# EAGLE design rftoy1.1 (EAGLE 7.1.0)
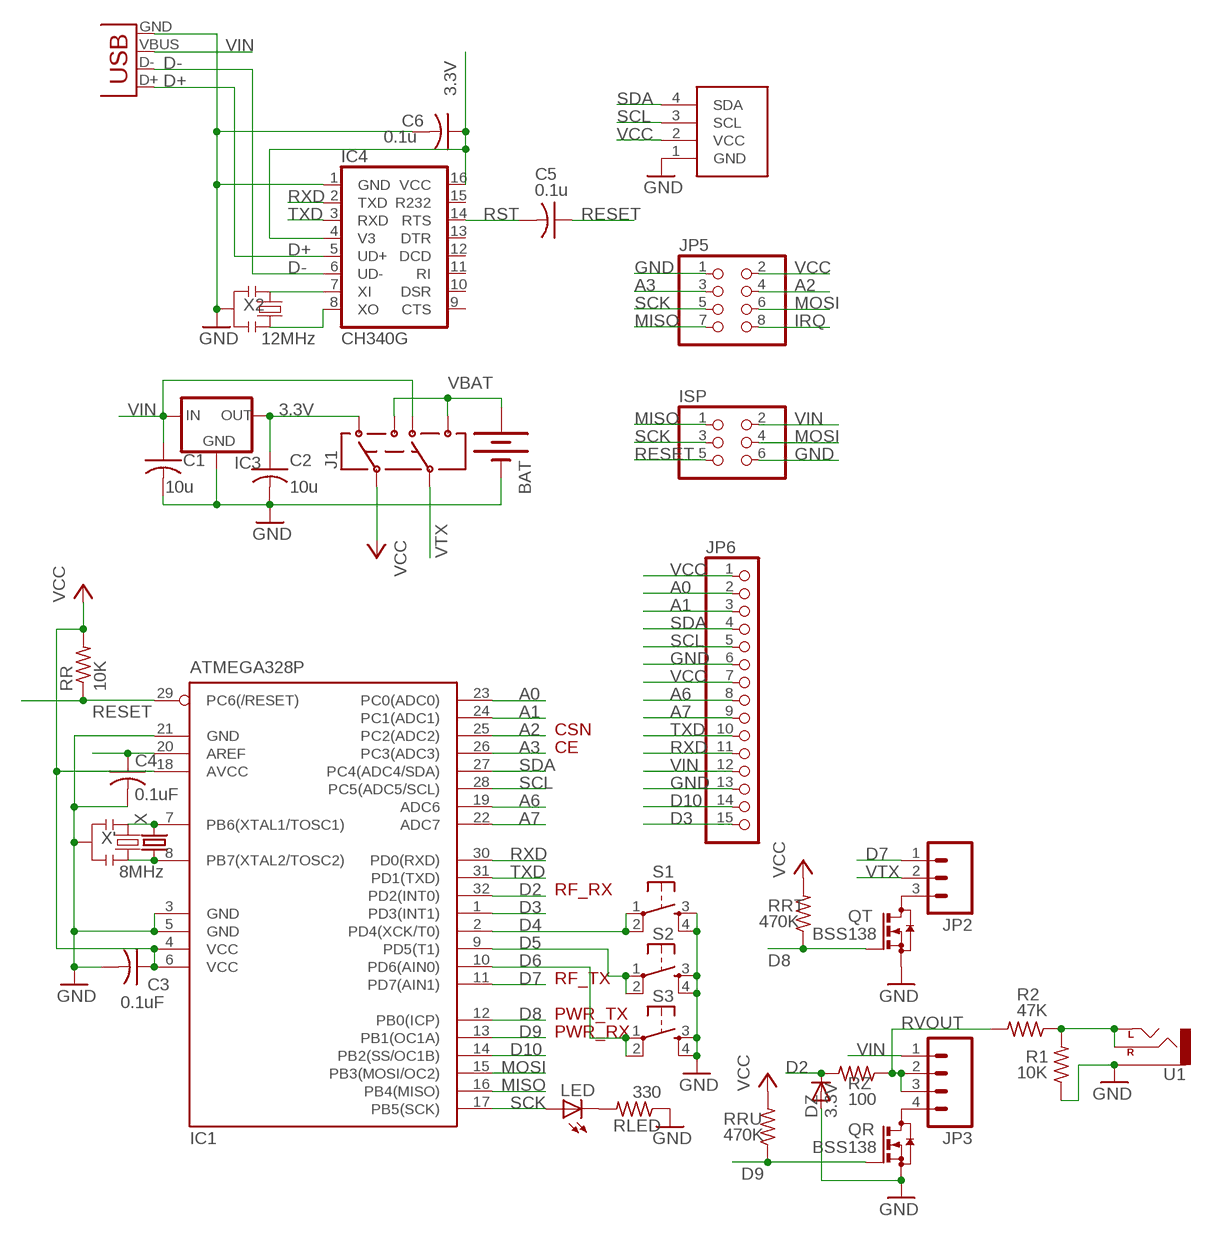
[diagram p0: schematic, sheet 1]

## Parts
BAT  BATTERY20PTH  [BATTCOM_20MM_PTH]
C1  10u  C-USC0805K  [C0805K]
C2  10u  C-USC0805K  [C0805K]
C3  0.1uF  C-USC0603K  [C0603K]
C4  0.1uF  C-USC0603K  [C0603K]
C5  0.1u  C-USC0603K  [C0603K]
C6  0.1u  C-USC0603K  [C0603K]
DZ  3.3V  DIODE-MINIMELF  [MINIMELF]
IC1  ATMEGA328P  MEGA8-AI  [TQFP32-08]
IC3  MCP1700SOT233  [SOT23]
IC4  CH340G  [SO16]
ISP  PINHD-2X3  [2X03]
J1  AYZ0202  [AYZ0202]
JP2  M03LOCK_LONGPADS  [1X03_LOCK_LONGPADS]
JP3  M04LOCK  [1X04_LOCK]
JP5  PINHD-2X4  [2X04]
JP6  PINHD-1X15-CB  [1X15-CB]
LED  LEDCHIPLED_0805  [CHIPLED_0805]
QR  BSS138  BSS123  [SOT23]
QT  BSS138  BSS123  [SOT23]
R1  10K  R-US_R0805  [R0805]
R2  47K  R-US_R0805  [R0805]
RLED  330  R-US_R0805  [R0805]
RR  10K  R-US_R0805  [R0805]
RRT  470K  R-US_R0805  [R0805]
RRU  470K  R-US_R0805  [R0805]
RZ  100  R-US_R0805  [R0805]
S1  TAC_SWITCHPTH  [TACTILE-PTH]
S2  TAC_SWITCHPTH  [TACTILE-PTH]
S3  TAC_SWITCHPTH  [TACTILE-PTH]
U1  AUDIO-JACKSMD3  [AUDIO-JACK-3.5MM-SMD3]
U$1  SSD1306_OLED_I2C  [SSD1306_OLED_I2C]
X  CRYSTALTC26V  [TC26V]
X1  USBSMD  [USB-MINIB]
X2  12MHz  RESONATORSMD  [RESONATOR-SMD]
X'  8MHz  RESONATORSMD  [RESONATOR-SMD]

## Nets
3.3V [power]: C2.1 C6.1 IC3.2(OUT) IC4.4(V3) IC4.16(VCC) J1.3
A0: IC1.23(PC0(ADC0)) JP6.2
A1: IC1.24(PC1(ADC1)) JP6.3
A2: IC1.25(PC2(ADC2)) JP5.4
A3: IC1.26(PC3(ADC3)) JP5.3
A6: IC1.19(ADC6) JP6.8
A7: IC1.22(ADC7) JP6.9
AREF: C4.1 IC1.20(AREF)
D2: DZ.C IC1.32(PD2(INT0)) RZ.2
D3: IC1.1(PD3(INT1)) JP6.15
D4: IC1.2(PD4(XCK/T0)) S1.1 S1.2
D5: IC1.9(PD5(T1)) S2.1 S2.2
D6: IC1.10(PD6(AIN0)) S3.1 S3.2
D7: IC1.11(PD7(AIN1)) JP2.1
D8: IC1.12(PB0(ICP)) QT.1(G) RRT.1
D9: IC1.13(PB1(OC1A)) QR.1(G) RRU.1
D10: IC1.14(PB2(SS/OC1B)) JP6.14
D+: IC4.5(UD+) X1.D+
D-: IC4.6(UD-) X1.D-
GND [power]: BAT.2(-) C1.2 C2.2 C3.2 C4.2 C6.2 DZ.A IC1.3(GND) IC1.5(GND) IC1.21(GND) IC3.1(GND) IC4.1(GND) ISP.6 JP5.1 JP6.6 JP6.13 QR.2(S) QT.2(S) R1.1 RLED.1 S1.3 S1.4 S2.3 S2.4 S3.3 S3.4 U1.RING(SLEEVE) U$1.1(GND) X1.GND X2.2 X'.2
IRQ: JP5.8
MISO: IC1.16(PB4(MISO)) ISP.1 JP5.7
MOSI: IC1.15(PB3(MOSI/OC2)) ISP.4 JP5.6
N$1: LED.C RLED.2
N$2: IC1.7(PB6(XTAL1/TOSC1)) X'.1 X.2
N$3: IC1.8(PB7(XTAL2/TOSC2)) X'.3 X.1
N$4: R1.2 R2.1 U1.MID(RIGHT) U1.TIP(LEFT)
N$6: JP3.4 QR.3(D)
N$8: JP2.3 QT.3(D)
N$11: IC4.7(XI) X2.1
N$13: IC4.8(XO) X2.3
RESET: C5.1 IC1.29(PC6(/RESET)) ISP.5 RR.1
RST: C5.2 IC4.14(RTS)
RVOUT: JP3.2 JP3.3 R2.2 RZ.1
RXD: IC1.30(PD0(RXD)) IC4.2(TXD) JP6.11
SCK: IC1.17(PB5(SCK)) ISP.3 JP5.5 LED.A
SCL: IC1.28(PC5(ADC5/SCL)) JP6.5 U$1.3(SCL)
SDA: IC1.27(PC4(ADC4/SDA)) JP6.4 U$1.4(SDA)
TXD: IC1.31(PD1(TXD)) IC4.3(RXD) JP6.10
VBAT [power]: BAT.1(+) J1.1 J1.4
VCC: C3.1 IC1.4(VCC) IC1.6(VCC) IC1.18(AVCC) J1.2 JP5.2 JP6.1 JP6.7 RR.2 RRT.2 RRU.2 U$1.2(VCC)
VIN [power]: C1.1 IC3.3(IN) ISP.2 J1.6 JP3.1 JP6.12 X1.VBUS
VTX [power]: J1.5 JP2.2
Unconnected: IC4.9(CTS) IC4.10(DSR) IC4.11(RI) IC4.12(DCD) IC4.13(DTR) IC4.15(R232)

## Notes on the sheet
- CSN
- CE
- RF_RX
- RF_TX
- PWR_TX
- PWR_RX

## Library data of the parts
BAT = SparkFun:BATTERY: Battery Holders Various common sizes : AA, AAA, 20mm coin cell and 12mm coin cell.
C1-C4 = adafruit2013:C-US: CAPACITOR, American symbol
C5 C6 = adafruit:C-US: CAPACITOR, American symbol
DZ = diode:DIODE-: DIODE
IC1 = atmel:MEGA8: MICROCONTROLLER 8 Kbytes FLASH, 1 kbytes SRAM, 512 bytes EEPROM, USART, 6-channel 10 bit ADC, 2-channel 8 bit ADC Pin compatible with Atmega48, ATMega88, ATMega168 Source: avr.lbr; MPN: ATMEGA8-16AU; OC_FARNELL: 9171371; OC_NEWARK: 73M8863
IC3 = adafruit:MCP1700: VOLTAGE REGULATOR
IC4 = SparkFunNew:CH340
ISP = pinhead:PINHD-2X3: PIN HEADER
J1 = SparkFunNew:AYZ0202: SPDT Slide Switch Simple SMD single-pull double-throw slide switch. Good for less than 350mA power switch, switching UARTs between devices, etc. Spark Fun Electronics SKU : COM-00597
JP2 = SparkFun:M03: Header 3 Standard 3-pin 0.1" header. Use with straight break away headers (SKU : PRT-00116), right angle break away headers (PRT-00553), swiss pins (PRT-00743), machine pins (PRT-00117), and female headers (PRT-00115). Molex polarized connector foot print use with SKU : PRT-08232 with associated crimp pins and housings.
JP3 = SparkFun:M04: Header 4 Standard 4-pin 0.1" header. Use with straight break away headers (SKU : PRT-00116), right angle break away headers (PRT-00553), swiss pins (PRT-00743), machine pins (PRT-00117), and female headers (PRT-00115). Molex polarized connector foot print use with SKU : PRT-08231 with associated crimp pins and housings.
JP5 = adafruit2013:PINHD-2X4: PIN HEADER
JP6 = adafruit2013:PINHD-1X15: PIN HEADER
LED = adafruit:LED: LED OSRAM: - CHIPLED LG R971, LG N971, LY N971, LG Q971, LY Q971, LO R971, LY R971 LH N974, LH R974 LS Q976, LO Q976, LY Q976 LO Q996 - Hyper CHIPLED LW Q18S LB Q993, LB Q99A, LB R99A - SideLED LS A670, LO A670, LY A670, LG A670, LP A670 LB A673, LV A673, LT A673, LW A673 LH A674 LY A675 LS A676, LA A676, LO A676, LY A676, LW A676 LS A679, LY A679, LG A679 - Hyper Micro SIDELED® LS Y876, LA Y876, LO Y876, LY Y876 LT Y87S - SmartLED LW L88C, LW L88S LB L89C, LB L89S, LG L890 LS L89K, LO L89K, LY L89K LS L896, LA L896, LO L896, LY L896 - TOPLED LS T670, LO T670, LY T670, LG T670, LP T670 LSG T670, LSP T670, LSY T670, LOP T670, LYG T670 LG T671, LOG T671, LSG T671 LB T673, LV T673, LT T673, LW T673 LH T674 LS T676, LA T676, LO T676, LY T676, LB T676, LH T676, LSB T676, LW T676 LB T67C, LV T67C, LT T67C, LS T67K, LO T67K, LY T67K, LW E67C LS E67B, LA E67B, LO E67B, LY E67B, LB E67C, LV E67C, LT E67C LW T67C LS T679, LY T679, LG T679 LS T770, LO T770, LY T770, LG T770, LP T770 LB T773, LV T773, LT T773, LW T773 LH T774 LS E675, LA E675, LY E675, LS T675 LS T776, LA T776, LO T776, LY T776, LB T776 LHGB T686 LT T68C, LB T68C - Hyper Mini TOPLED® LB M676 - Mini TOPLED Santana® LG M470 LS M47K, LO M47K, LY M47K Source: http://www.osram.convergy.de/
QR QT = transistor-small-signal:BSS123: N-CHANNEL MOS FET
R1 R2 RLED RR RRT RRU RZ = adafruit2013:R-US_: RESISTOR, American symbol
S1-S3 = SparkFunNew:TAC_SWITCH: Momentary Switch Button commonly used for reset or general input. Spark Fun Electronics SKU : COM-00097
U1 = SparkFunNew:AUDIO-JACK: 3.5mm Audio Jack Simple 3.5mm common PCB mount audio jack. SKU: PRT-08032
U$1 = adafruit2013:SSD1306_OLED_I2C
X = adafruit2013:CRYSTAL: CRYSTAL; OC_FARNELL: unknown; OC_NEWARK: unknown
X1 = SparkFun:USB: USB Connectors USB-B-PTH is fully proven SKU : PRT-00139 USB-miniB is fully proven SKU : PRT-00587 USB-A-PCB is untested. USB-A-H is throughly reviewed, but untested. Spark Fun Electronics SKU : PRT-00437 USB-B-SMT is throughly reviewed, but untested. Needs silkscreen touching up. USB-A-S has not been used/tested USB-MB-H has not been used/tested
X2 X' = SparkFunNew:RESONATOR: Resonator Small SMD resonator. This is the itty bitty 10/20MHz resonators with built in caps. CSTCE10M0G55 and CSTCE20M0V53. Footprint has been reviewed closely but hasn't been tested yet.

## Net classes
0 default: width 0.178 mm, clearance 0.178 mm
1 power: width 0.203 mm, clearance 0.203 mm

## Board
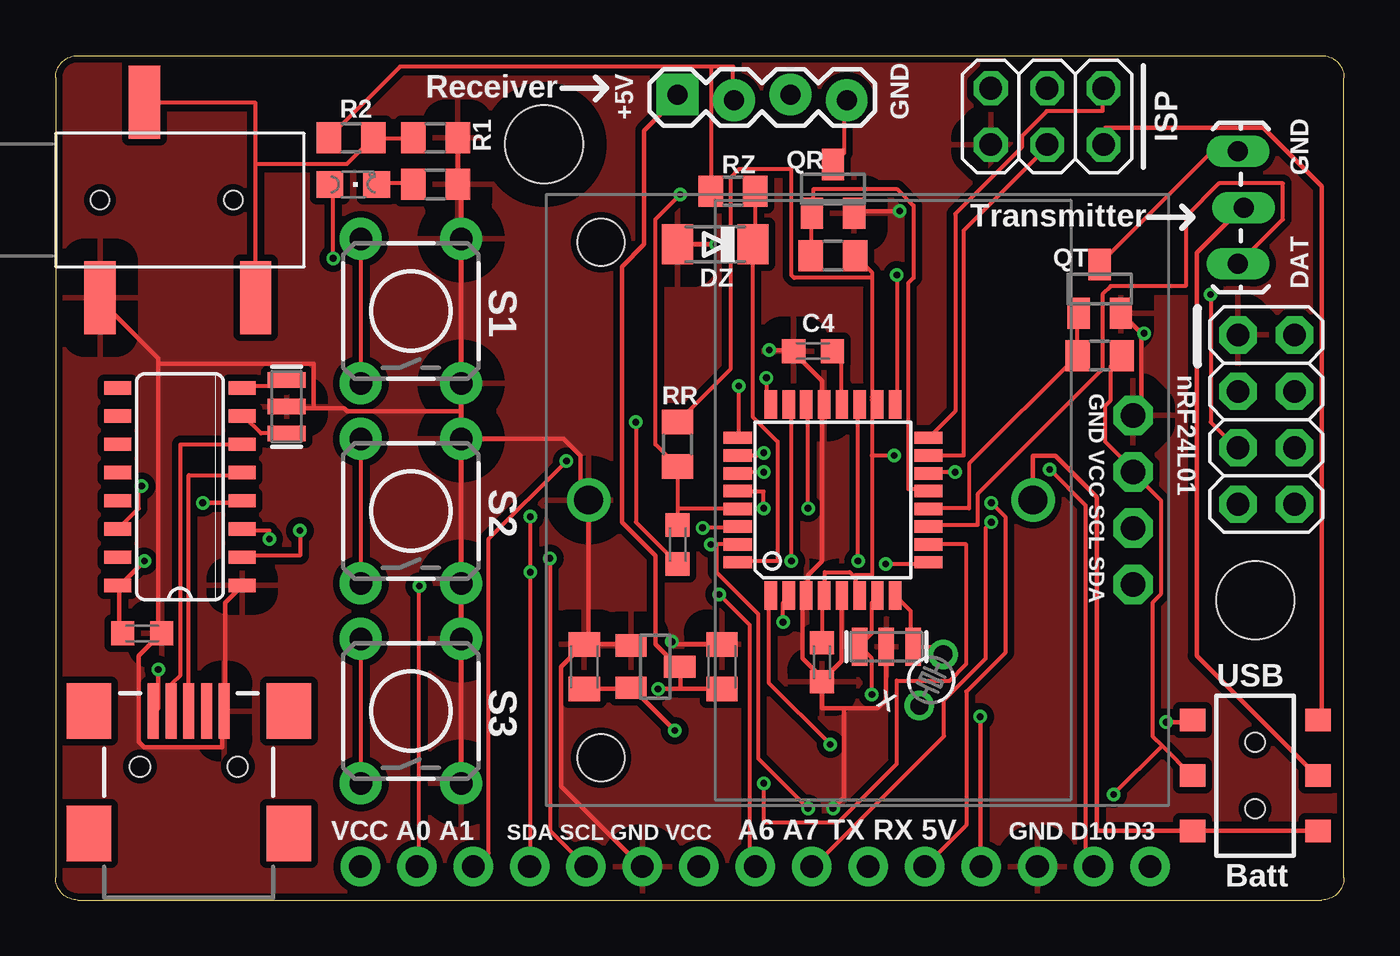
[diagram p1: board, top side]
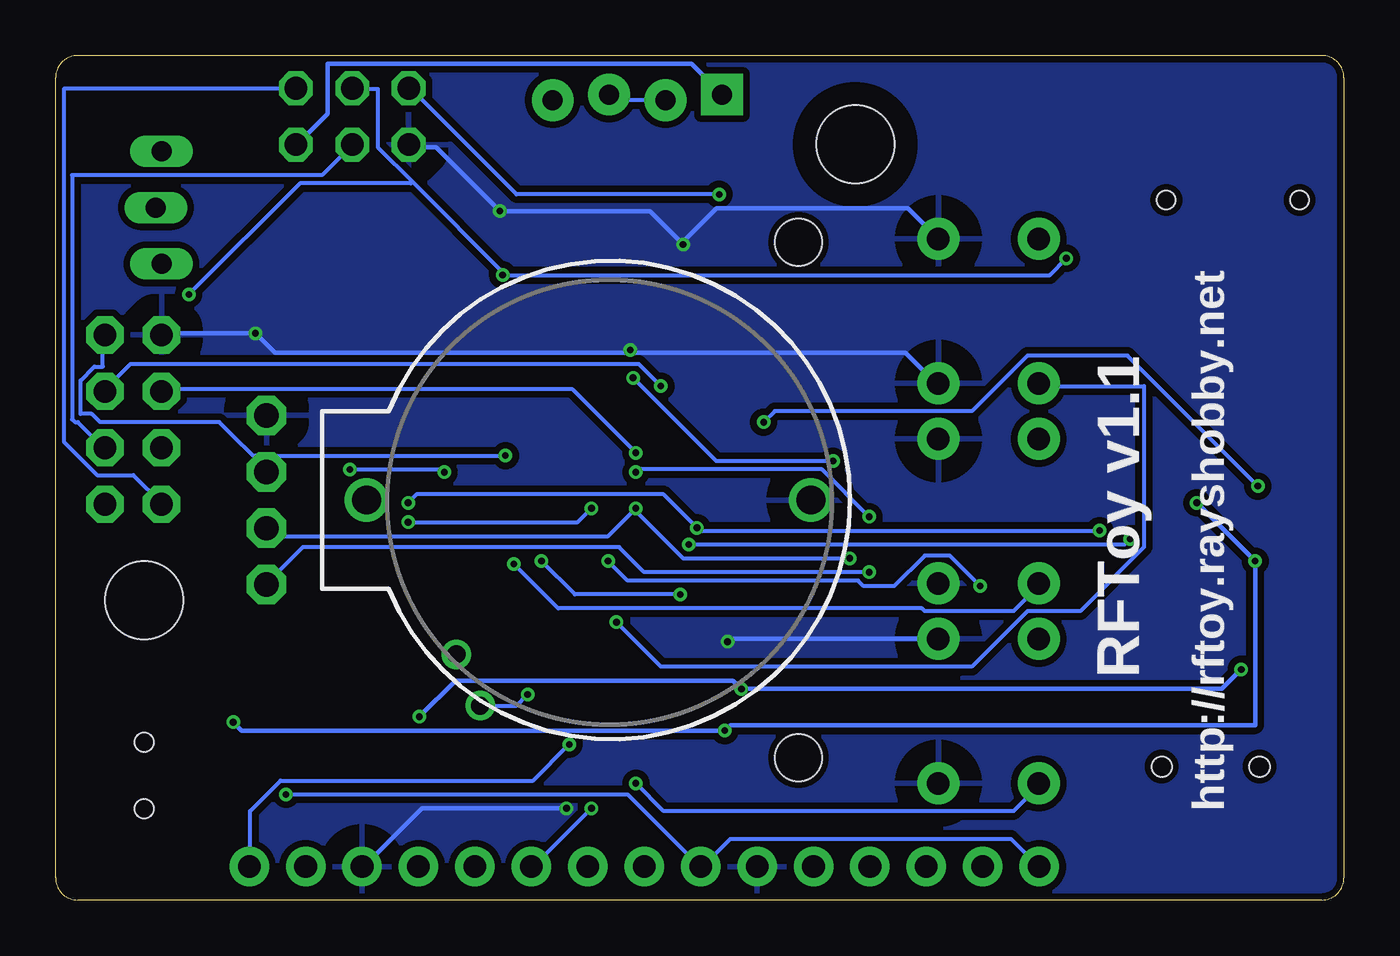
[diagram p2: board, bottom side, seen from below]

Size 58 x 38 mm. Coordinates in mm from the lower left corner, seen from the top.
Outline: 0,37 0,1 arc90 1,0 57,0 arc90 58,1 58,37 arc90 57,38 1,38 arc90 0,37
Copper layers (1*16): Top 0.035mm / dielectric 1.5mm / Bottom 0.035mm
Design rules "Fusion_eagle_rule_v1.1 *": minimum track width 6mil, minimum drill 12mil, track to track 6mil, track to pad 6mil, pad to pad 6mil, via to via 6mil, smd to smd 0mil, copper to edge 10mil, drill to drill 10mil, minimum pad ring 10mil, minimum via ring 6mil, stop-mask expansion 2mil, vias tented up to drill 100mil, thermal gap 40mil
Holes 3.5 mm at 22,34 54,13.5
tRestrict: area 19.5,31.5 to 24.5,36.5; area 51.5,11 to 56.5,16
bRestrict: area 19.5,31.5 to 24.5,36.5; area 51.5,11 to 56.5,16
vRestrict: area 50.5,17.8 to 51.3,23.6; area 55.6,27.5 to 56.4,29.6; area 55.6,32.6 to 56.4,34.7; area 37.6,35.1 to 38.4,37.2; area 25.2,35.1 to 26,37.2; area 12.6,2.7 to 50.1,3.5

### Footprints (pad centres in the part's own frame; a part is rotated, then mirrored left to right if it is on the bottom)
BATTCOM_20MM_PTH = drill 1.3: 1 20,0; 2 0,0
C0805K = smd 1.1 x 1.4: 1 -1,0; 2 1,0
C0603K = smd 1.05 x 1.08: 1 -0.875,0; 2 0.875,0
MINIMELF = smd 1.4 x 1.8: A 1.7,0; C -1.7,0
TQFP32-08 = smd 1.27 x 0.559: 1 -4.293,2.8; 2 -4.293,2; 3 -4.293,1.2; 4 -4.293,0.4; 5 -4.293,-0.4; 6 -4.293,-1.2; 7 -4.293,-2; 8 -4.293,-2.8; 17 4.293,-2.8; 18 4.293,-2; 19 4.293,-1.2; 20 4.293,-0.4; 21 4.293,0.4; 22 4.293,1.2; 23 4.293,2; 24 4.293,2.8 | smd 0.559 x 1.27: 9 -2.8,-4.293; 10 -2,-4.293; 11 -1.2,-4.293; 12 -0.4,-4.293; 13 0.4,-4.293; 14 1.2,-4.293; 15 2,-4.293; 16 2.8,-4.293; 25 2.8,4.293; 26 2,4.293; 27 1.2,4.293; 28 0.4,4.293; 29 -0.4,4.293; 30 -1.2,4.293; 31 -2,4.293; 32 -2.8,4.293
SOT23 = smd 1 x 1.4: 1 -0.95,-1.1; 2 0.95,-1.1; 3 0,1.1
SO16 = smd 0.6 x 1.2: 1 -4.445,-2.8; 2 -3.175,-2.8; 3 -1.905,-2.8; 4 -0.635,-2.8; 5 0.635,-2.8; 6 1.905,-2.8; 7 3.175,-2.8; 8 4.445,-2.8; 9 4.445,2.8; 10 3.175,2.8; 11 1.905,2.8; 12 0.635,2.8; 13 -0.635,2.8; 14 -1.905,2.8; 15 -3.175,2.8; 16 -4.445,2.8
2X03 = drill 1.016 octagon: 1 -2.54,-1.27; 2 -2.54,1.27; 3 0,-1.27; 4 0,1.27; 5 2.54,-1.27; 6 2.54,1.27
AYZ0202 = smd 1 x 1.15: 1 -2.5,2.825; 2 0,2.825; 3 2.5,2.825; 4 -2.5,-2.825; 5 0,-2.825; 6 2.5,-2.825 | hole 0.85: 1.5,0; -1.5,0
1X03_LOCK_LONGPADS = drill 0.9 long: 1 0,0; 2 2.54,-0.254; 3 5.08,0
1X04_LOCK = drill 0.9 pad 1.88 square: 1 0,0.127 | drill 0.9 pad 1.88: 2 2.54,-0.127; 3 5.08,0.127; 4 7.62,-0.127
2X04 = drill 1.016 pad 1.676 octagon: 1 -3.81,-1.27; 2 -3.81,1.27; 3 -1.27,-1.27; 4 -1.27,1.27; 5 1.27,-1.27; 6 1.27,1.27; 7 3.81,-1.27; 8 3.81,1.27
1X15-CB = drill 1.016 pad 1.778: 1 -17.78,0; 2 -15.24,0; 3 -12.7,0; 4 -10.16,0; 5 -7.62,0; 6 -5.08,0; 7 -2.54,0; 8 0,0; 9 2.54,0; 10 5.08,0; 11 7.62,0; 12 10.16,0; 13 12.7,0; 14 15.24,0; 15 17.78,0
CHIPLED_0805 = smd 1.2 x 1.2: A 0,-1.05; C 0,1.05
R0805 = smd 1.1 x 1.4: 1 -1,0; 2 1,0
TACTILE-PTH = drill 1.016 pad 1.88: 1 -3.251,2.261; 2 3.251,2.261; 3 -3.251,-2.261; 4 3.251,-2.261
AUDIO-JACK-3.5MM-SMD3 = smd 1.4 x 3.3: MID 4,4.4; RING 2,-4.4; TIP 9,-4.4 | hole 0.82: 2,0; 8,0
SSD1306_OLED_I2C = drill 1.1 pad 1.778 octagon: 1 -3.81,0; 2 -1.27,0; 3 1.27,0; 4 3.81,0 | hole 2.1: 11.6,-23.95; -11.6,-23.95
TC26V = drill 0.813: 1 -1.27,0; 2 1.27,0
USB-MINIB = smd 2.5 x 0.5: D+ 2.5,0; D- 2.5,0.8; GND 2.5,-1.6; ID 2.5,-0.8; VBUS 2.5,1.6 | smd 2.5 x 2: GND@1 -3,-4.5; GND@2 -3,4.5; GND@3 2.5,4.5; GND@4 2.5,-4.5 | hole 0.9: 0,2.2; 0,-2.2
RESONATOR-SMD = smd 0.7 x 1.7: 1 -1.2,0; 2 0,0; 3 1.2,0

### Placement (x,y rotation side)
BAT  24,18 180 bottom
C1  30,10.5 90 top
C2  23.8,10.5 90 top
C3  34.5,10.7 270 top
C4  34.1,24.7 180 top
C5  28,16 270 top
C6  3.9,12 0 top
DZ  29.7,29.5 180 top
IC1  35,18 90 top
IC3  27,10.5 270 top
IC4  5.6,18.6 90 top
ISP  44.64,35.26 180 top
J1  54,5.6 90 top
JP2  53.23,28.62 90 top
JP3  28,36.12 0 top
JP5  54.5,21.62 270 top
JP6  31.5,1.5 0 top
LED  13.4,32.2 270 top
QR  35,32 0 top
QT  47,27.5 0 top
R1  17.1,34.3 180 top
R2  13.3,34.3 180 top
RLED  17.1,32.2 180 top
RR  28,20.5 90 top
RRT  47,24.5 0 top
RRU  35,29 0 top
RZ  30.5,31.9 0 top
S1  16,26.5 90 top
S2  16,17.5 90 top
S3  16,8.5 90 top
U1  0,31.5 0 top
U$1  48.5,18 270 top
X  39.42,9.9 245 top
X1  6,6 90 top
X2  10.4,22.2 90 top
X'  37.4,11.4 0 top

### Tracks (layer width: path | path; a pad name or v marks a point on that pad's centre or on a via)
3.3V  (via drill 0.3)
  Top 0.203: 2.88,14.12 2.88,12.12 3,12 C6.1 | v6.62,17.88 8.38,17.88 IC4.4 | 2.88,14.12 v4,15.25 | 2.88,14.12 IC4.16 | v50,8 51.12,8 J1.3 | v27.88,7.62 26,9.5 IC3.2 25.88,9.5 C2.1
  Bottom 0.203: v6.62,17.88 v4,15.25 4,7.88 27.62,7.88 v27.88,7.62 49.62,7.62 v50,8
A0  (via drill 0.3)
  Top 0.178: v33.12,15.25 33.12,22.12 33,22.25 IC1.23 | v16.38,14.12 16.38,1.5 JP6.2
  Bottom 0.178: v33.12,15.25 32.25,14.38 21.88,14.38 21.62,14.12 20.25,14.12 18.88,15.5 17.75,15.5 v16.38,14.12
A1  (via drill 0.3)
  Top 0.178: v32,23.5 32,22.5 32.12,22.38 IC1.24 | v23,19.75 19.5,16.25 19.5,2.12 18.88,1.5 JP6.3
  Bottom 0.178: v32,23.5 28.25,19.75 v23,19.75
A2  (via drill 0.3)
  Top 0.178: v30.75,23.12 30.75,20.88 IC1.25
  Bottom 0.178: v30.75,23.12 31.75,24.12 54.62,24.12 55.75,23 JP5.4
A3  (via drill 0.3)
  Top 0.178: IC1.26 31.88,20 v31.88,20.12
  Bottom 0.178: v31.88,20.12 34.75,23 53.12,23 JP5.3
A6  (via drill 0.3)
  Top 0.178: v36.12,15.25 36.12,22.25 IC1.19 | v29.88,13.75 31.25,12.38 31.25,1.75 JP6.8
  Bottom 0.178: v36.12,15.25 34.62,13.75 v29.88,13.75
A7  (via drill 0.3)
  Top 0.178: v33.88,17.62 33.88,22.25 IC1.22 | v42.12,17 41.88,16.75 41.88,10.88 40,9 40,7.38 34.12,1.5 JP6.9
  Bottom 0.178: v33.88,17.62 34.5,17 v42.12,17
AREF
  Top 0.178: C4.1 35,24.62 35.38,24.25 35.38,22.38 IC1.20
D2
  Top 0.178: IC1.32 30.75,15.25 32.5,15.25 32.5,20.62 31.38,21.75 31.38,29.5 DZ.C 31.5,29.5 RZ.2
D3  (via drill 0.3)
  Top 0.178: v34.88,7 32.12,9.75 32.12,13.62 IC1.1
  Bottom 0.178: v34.88,7 36.5,5.38 47.88,5.38 49.25,4 49.25,1.5 JP6.15
D4  (via drill 0.3)
  Top 0.178: v32.75,12.5 32.75,13.38 33,13.62 IC1.2 | S1.2 S1.1
  Bottom 0.178: v32.75,12.5 30.75,10.5 16.75,10.5 14.25,13 11.88,13 9,15.88 9,23.12 13.62,23.12 S1.1
D5  (via drill 0.3)
  Top 0.178: v37.38,15.12 39.25,15.12 IC1.9 | S2.2 S2.1
  Bottom 0.178: v37.38,15.12 35.38,13.12 19,13.12 18.88,13 14.88,13 13.75,14.12 S2.1
D6  (via drill 0.3)
  Top 0.178: IC1.10 41,16 41,10.62 40.25,9.88 37.88,9.88 37.88,6.12 35.25,3.5 31.88,3.5 v31.88,5.25 | S3.2 S3.1
  Bottom 0.178: v31.88,5.25 30.62,4 14.88,4 13.75,5.12 S3.1
D7
  Top 0.178: IC1.11 39.38,16.88 41.5,16.88 41.5,18.25 47.12,23.88 47.12,27.25 47.5,27.62 50.88,27.62 50.88,30.75 52.38,32.25 55.25,32.25 55.25,30.62 53.25,28.62 JP2.1
D8
  Top 0.178: IC1.12 39.38,17.62 41.12,17.62 41.12,19.62 RRT.1 46,26.38 QT.1
D9
  Top 0.178: IC1.13 39.25,18.5 38.38,18.5 38.38,27.75 38.62,28 38.62,31.25 37.88,32 34.12,32 34.12,31 QR.1 34,30.88 RRU.1
D10  (via drill 0.3)
  Top 0.178: v40.5,19.25 39.38,19.25 IC1.14 | v44.75,19.38 46.38,17.75 46.38,1.75 46.62,1.5 JP6.14
  Bottom 0.178: v40.5,19.25 40.62,19.38 v44.75,19.38
D+
  Top 0.178: X1.D+ 6,19.12 8.38,19.12 IC4.5
D-
  Top 0.178: IC4.6 8.38,20.5 5.62,20.5 5.62,10.12 5.25,9.75 5.25,8.5 X1.D-
GND  (via drill 0.3)
  Top 0.203: IC1.21 34.5,22.38 34.5,23.38 33.25,24.62 C4.2 33.12,24.75 v32.12,24.75 | 34.62,22.38 IC1.21 | C3.2 34.5,9.88 35.38,10.75 35.38,13.62 IC1.5 | C3.2 34.5,10 33.62,10.88 33.62,13.5 33.75,13.62 IC1.3 33.88,13.75 33.88,14.62 34.5,15.25 34.5,22.25 IC1.21 | 35.5,8.62 34.5,8.62 C3.2 | 35.5,8.62 37,8.62 37.38,9 37.38,11.38 X'.2 | v35,4.12 35.5,4.62 35.5,8.62 | IC4.1 8.38,14.12 7.62,13.38 7.62,8.5 X1.GND 7.5,8.5 7.5,6.88 4,6.88 3.75,7.12 3.75,11 4.75,12 C6.2 4.62,12 4.62,24.12 | 4.62,24.12 4.62,24.38 2,27 U1.RING | C1.2 27.75,11.5 v27.75,11.62 | S3.3 S3.4 18.25,11.88 18.25,14.12 S2.3 S2.4 | 24,11.5 25.88,11.5 IC3.1 | 24,11.5 C2.2 | 24,11.5 BAT.2 23.62,18.38 23.62,20 22.88,20.75 18.38,20.75 S2.4 | 23.88,11.5 C2.2 | JP6.6 26.38,1.5 22.75,5.12 22.75,10.5 23.75,11.5 C2.2 | v38,31 36,31 QR.2 | v29.75,29.5 DZ.A | 48.88,25.5 48,26.38 QT.2 | 48.88,25.5 48.88,22.25 48.5,21.88 U$1.1 | 48.88,25.5 v49,25.5 | R1.1 18.12,34.25 18.12,32.25 RLED.1 18.12,32.12 18.25,32 18.25,29.88 S1.4 S1.3 18.25,23.12 18.25,22 | 11.62,22.12 13,22.12 13.12,22 18.25,22 | 11.62,22.12 10.5,22.12 X2.2 | 18.25,22 18.25,20.88 S2.4 | 4.62,24.12 11.62,24.12 11.62,22.12
  Bottom 0.203: v35,4.12 41.5,4.12 44.12,1.5 JP6.13 | v27.75,11.62 27.62,11.75 18.38,11.75 S3.4 | ISP.6 42,33.88 40.88,33.88 v38,31 31.25,31 v29.75,29.5 29.75,29.62 28.25,31.12 19.62,31.12 18.38,29.88 S1.4 | JP5.1 53.12,25.5 v49,25.5 48.12,24.62 32.12,24.62 | 32.12,24.62 19.75,24.62 18.38,23.25 S1.3 | 32.12,24.62 v32.12,24.75
  pour Top (isolate 0.305): 0,38 58,38 58,0 0,0
  pour Bottom (isolate 0.305): 0,38 58,38 58,0 0,0
MISO
  Top 0.178: IC1.16 39.38,20.88 40.5,22 40.5,30.88 43.5,33.88 43.5,34.38 44.62,35.5 47.12,35.5 47.12,36.5 ISP.1
  Bottom 0.178: JP5.7 53.25,17.88 54.5,19.12 56.12,19.12 57.62,20.62 57.62,36.5 47.25,36.5 ISP.1
MOSI
  Top 0.178: IC1.15 40.88,20 40.88,30.12 44.62,33.88 ISP.4
  Bottom 0.178: JP5.6 55.88,20.38 57,21.5 57.12,21.5 57.25,21.62 57.25,32.62 46,32.62 44.75,33.88 ISP.4
N$1
  Top 0.178: LED.C 14.5,32.25 16,32.25 RLED.2
N$2  (via drill 0.3)
  Top 0.178: IC1.7 37,13.62 36.75,13.38 36.75,12 36.25,11.5 X'.1 36.25,11.38 36.75,10.88 v36.75,9.25
  Bottom 0.178: v36.75,9.25 37.25,8.75 X.2
N$3
  Top 0.178: IC1.8 37.88,13.62 38.5,13 38.5,11.5 X'.3 38.62,11.38 39.88,11.38 39.88,11.12 X.1
N$4
  Top 0.178: R1.2 16,34.25 14.38,34.25 R2.1 13.12,33.12 9,33.12 | U1.TIP 9,33.12 | 9,33.12 9,35.88 4,35.88 U1.MID
N$6
  Top 0.178: QR.3 35,33.12 35.5,33.62 35.5,35.88 JP3.4
N$8
  Top 0.178: QT.3 47,28.62 52,33.62 53.12,33.62 JP2.3
N$11
  Top 0.178: X2.1 9.25,21 8.5,21.75 IC4.7
N$13
  Top 0.178: IC4.8 8.5,23.12 10.38,23.12 10.38,23.38 X2.3
RESET  (via drill 0.3)
  Top 0.178: 28,17.62 RR.1 27,20.5 27,30.62 v28.12,31.75 | 28,17.62 C5.1 | 28,17.62 30.62,17.62 IC1.29
  Bottom 0.178: v28.12,31.75 37.25,31.75 42,36.5 ISP.5
RST  (via drill 0.3)
  Top 0.178: C5.2 26.12,17 v26.12,21.5 | v3.88,18.62 3.75,18.5 3.75,17.62 2.88,16.75 IC4.14
  Bottom 0.178: v26.12,21.5 25.62,22 16.75,22 14.25,24.5 9.75,24.5 v3.88,18.62
RVOUT
  Top 0.178: R2.2 15.5,37.5 29.5,37.5 | 29.5,37.5 30.5,37.5 30.5,36 JP3.2 | 29.5,37.5 RZ.1
  Bottom 0.178: JP3.3 33,36.12 32.88,36 30.62,36 JP3.2
RXD  (via drill 0.3)
  Top 0.178: v11,16.62 11,15.5 8.5,15.5 IC4.2 | v29.12,16.75 30.62,16.75 IC1.30 | v42.12,17.88 42.75,17.25 42.75,11.12 41,9.38 41,3.38 JP6.11
  Bottom 0.178: v11,16.62 29,16.62 v29.12,16.75 30.62,18.25 41.75,18.25 v42.12,17.88
SCK  (via drill 0.3)
  Top 0.178: v12.5,28.88 12.5,32 12.38,32.12 LED.A | v37.88,28.12 37.88,22.38 IC1.17 | v52,27.25 52,21.5 53.12,20.38 JP5.5
  Bottom 0.178: v12.5,28.88 13.25,28.12 37.75,28.12 37.81,28.19 | 41.94,32.31 43.5,33.88 43.5,36.5 44.62,36.5 ISP.3 | 41.94,32.31 37.81,28.19 | v37.88,28.12 37.81,28.19 | v52,27.25 47,32.25 42,32.25 41.94,32.31
SCL  (via drill 0.3)
  Top 0.178: v31.88,17.62 31.88,18.38 30.75,18.38 IC1.28 | v22.25,15.38 22.25,3.12 JP6.5
  Bottom 0.178: U$1.3 48.5,16.62 48.25,16.38 33.12,16.38 v31.88,17.62 31.88,17.5 29.75,15.38 v22.25,15.38
SDA  (via drill 0.3)
  Top 0.178: v31.88,19.25 30.75,19.25 IC1.27 | v21.38,17.25 v21.38,14.75 21.38,1.5 JP6.4
  Bottom 0.178: v31.88,19.25 31.75,19.38 23.5,19.38 v21.38,17.25 | v21.38,14.75 31.5,14.75 32.62,15.88 46.88,15.88 48.5,14.25 U$1.4
TXD  (via drill 0.3)
  Top 0.178: v9.62,16.25 9.62,16.62 8.5,16.62 IC4.3 | IC1.31 29.75,16 | v33.88,4.12 31.62,6.38 31.62,12.88 29.75,14.75 29.75,16 | 29.75,16 v29.5,16
  Bottom 0.178: v9.62,16.25 9.88,16 v29.5,16 | v33.88,4.12 36.5,1.5 JP6.10
VBAT
  Top 0.203: J1.4 56.75,3.12 51.25,3.12 J1.1 51.12,3.12 46.88,3.12 46.88,18.12 45,20 44,20 BAT.1
VCC  (via drill 0.3)
  Top 0.178: C3.1 34.5,13.62 IC1.4 34.62,13.75 34.62,14.75 35.75,14.75 35.94,14.56 | 35.94,14.56 36,14.5 36,13.88 36.12,13.75 IC1.6 | 36.75,28 36.75,28.25 RRU.2 | 36.75,28 36.75,22.62 37,22.38 IC1.18 36.75,22.5 36.75,20 | RR.2 30.38,23.88 30.38,32.5 30.75,32.88 33.12,32.88 33.12,28.12 33.25,28 36.75,28 | 36.75,20 36.75,14.62 36,14.62 35.94,14.56 | 49.81,6.94 49.38,7.38 49.38,13.38 49.75,13.75 49.75,18 48.5,19.25 U$1.2 48.5,19.38 47.25,20.62 47.25,22.25 47.5,22.5 47.5,24 RRT.2 | 49.81,6.94 51.12,5.62 J1.2 | 49.81,6.94 v47.62,4.75 | v37.75,20 36.75,20
  Bottom 0.178: JP6.1 13.75,1.5 15,2.75 27.62,2.75 28.88,1.5 JP6.7 29,1.5 32.25,4.75 v47.62,4.75 | JP5.2 55.88,25.38 55.88,24 56.25,24 56.88,23.38 56.88,21.88 56.38,21.88 56,21.5 50.62,21.5 48.5,19.38 U$1.2 49,20 v37.75,20
VIN  (via drill 0.3)
  Top 0.203: J1.6 56.88,8.12 57,8.25 57,32.12 54.38,34.75 47.25,34.75 47.25,34 ISP.2 | 28.12,9.5 C1.1 | 28.12,9.5 28.12,10.5 IC3.3 28,10.5 27,11.5 27,15.5 25.5,17 25.5,28.5 26.5,29.5 26.5,34.62 28,36.12 JP3.1 | v4.62,10.38 4.62,8.62 4.5,8.5 X1.VBUS | 28.12,9.5 v27.12,9.5 | v41.62,8.25 41.62,1.5 JP6.12
  Bottom 0.203: v4.62,10.38 5.5,9.5 v27.12,9.5 27.5,9.88 40,9.88 v41.62,8.25 | ISP.2 47.12,34 45.75,35.38 45.75,37.62 29.38,37.62 JP3.1
VTX
  Top 0.203: J1.5 56.75,5.62 51.38,11 51.38,29.12 53.38,31.12 JP2.2

### Text on the board
tNames: Receiver | +5V | GND | GND | Transmitter | DAT | nRF24L01 | USB | VCC A0 A1 | SDA SCL GND VCC | A6 A7 TX RX 5V | GND D10 D3 | Batt
bNames: RFToy v1.1 | http://rftoy.rayshobby.net